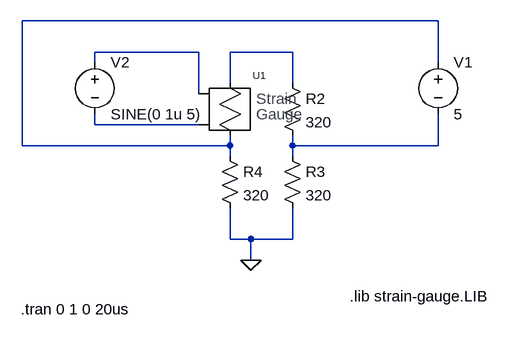
[diagram p0: schematic T5_1_sg.asc]
T5_1_sg.asc, the LTspice schematic file:
Version 4
SHEET 1 880 680
WIRE 256 -32 -384 -32
WIRE -112 16 -272 16
WIRE 32 16 -64 16
WIRE -272 32 -272 16
WIRE 256 32 256 -32
WIRE -64 64 -64 16
WIRE 32 64 32 16
WIRE -112 80 -112 16
WIRE -272 128 -272 112
WIRE -112 128 -272 128
WIRE -384 160 -384 -32
WIRE -64 160 -64 144
WIRE -64 160 -384 160
WIRE 32 160 32 144
WIRE 256 160 256 112
WIRE 256 160 32 160
WIRE -64 176 -64 160
WIRE 32 176 32 160
WIRE -64 304 -64 256
WIRE -32 304 -64 304
WIRE 32 304 32 256
WIRE 32 304 -32 304
WIRE -32 336 -32 304
FLAG -32 336 0
SYMBOL voltage 256 16 R0
WINDOW 123 0 0 Left 0
WINDOW 39 0 0 Left 0
SYMATTR InstName V1
SYMATTR Value 5
SYMBOL res 16 48 R0
SYMATTR InstName R2
SYMATTR Value 320
SYMBOL res 16 160 R0
SYMATTR InstName R3
SYMATTR Value 320
SYMBOL res -80 160 R0
SYMATTR InstName R4
SYMATTR Value 320
SYMBOL strain-gauge -80 48 R0
SYMATTR SpiceLine R=320 L=0.32 k=1.76 n=32
SYMATTR InstName U1
SYMBOL voltage -272 16 R0
WINDOW 123 0 0 Left 0
WINDOW 39 0 0 Left 0
SYMATTR InstName V2
SYMATTR Value SINE(0 1u 5)
TEXT 120 392 Left 2 !.lib strain-gauge.LIB
TEXT -386 412 Left 2 !.tran 0 1 0 20us

The netlist it stands for:
* T5_1_sg.asc
V1 N001 N005 5
R2 N003 N005 320
R3 N005 0 320
R4 N001 0 320
XU1 N003 N001 N002 N004 strain-gauge R=320 L=0.32 k=1.76 n=32  ; pins 1 2 3 4
V2 N002 N004 SINE(0 1u 5)
.lib strain-gauge.LIB
.tran 0 1 0 20us
.lib strain-gauge.LIB
.backanno
.end